# EAGLE design sdcard_noBMP (EAGLE 9.6.0)
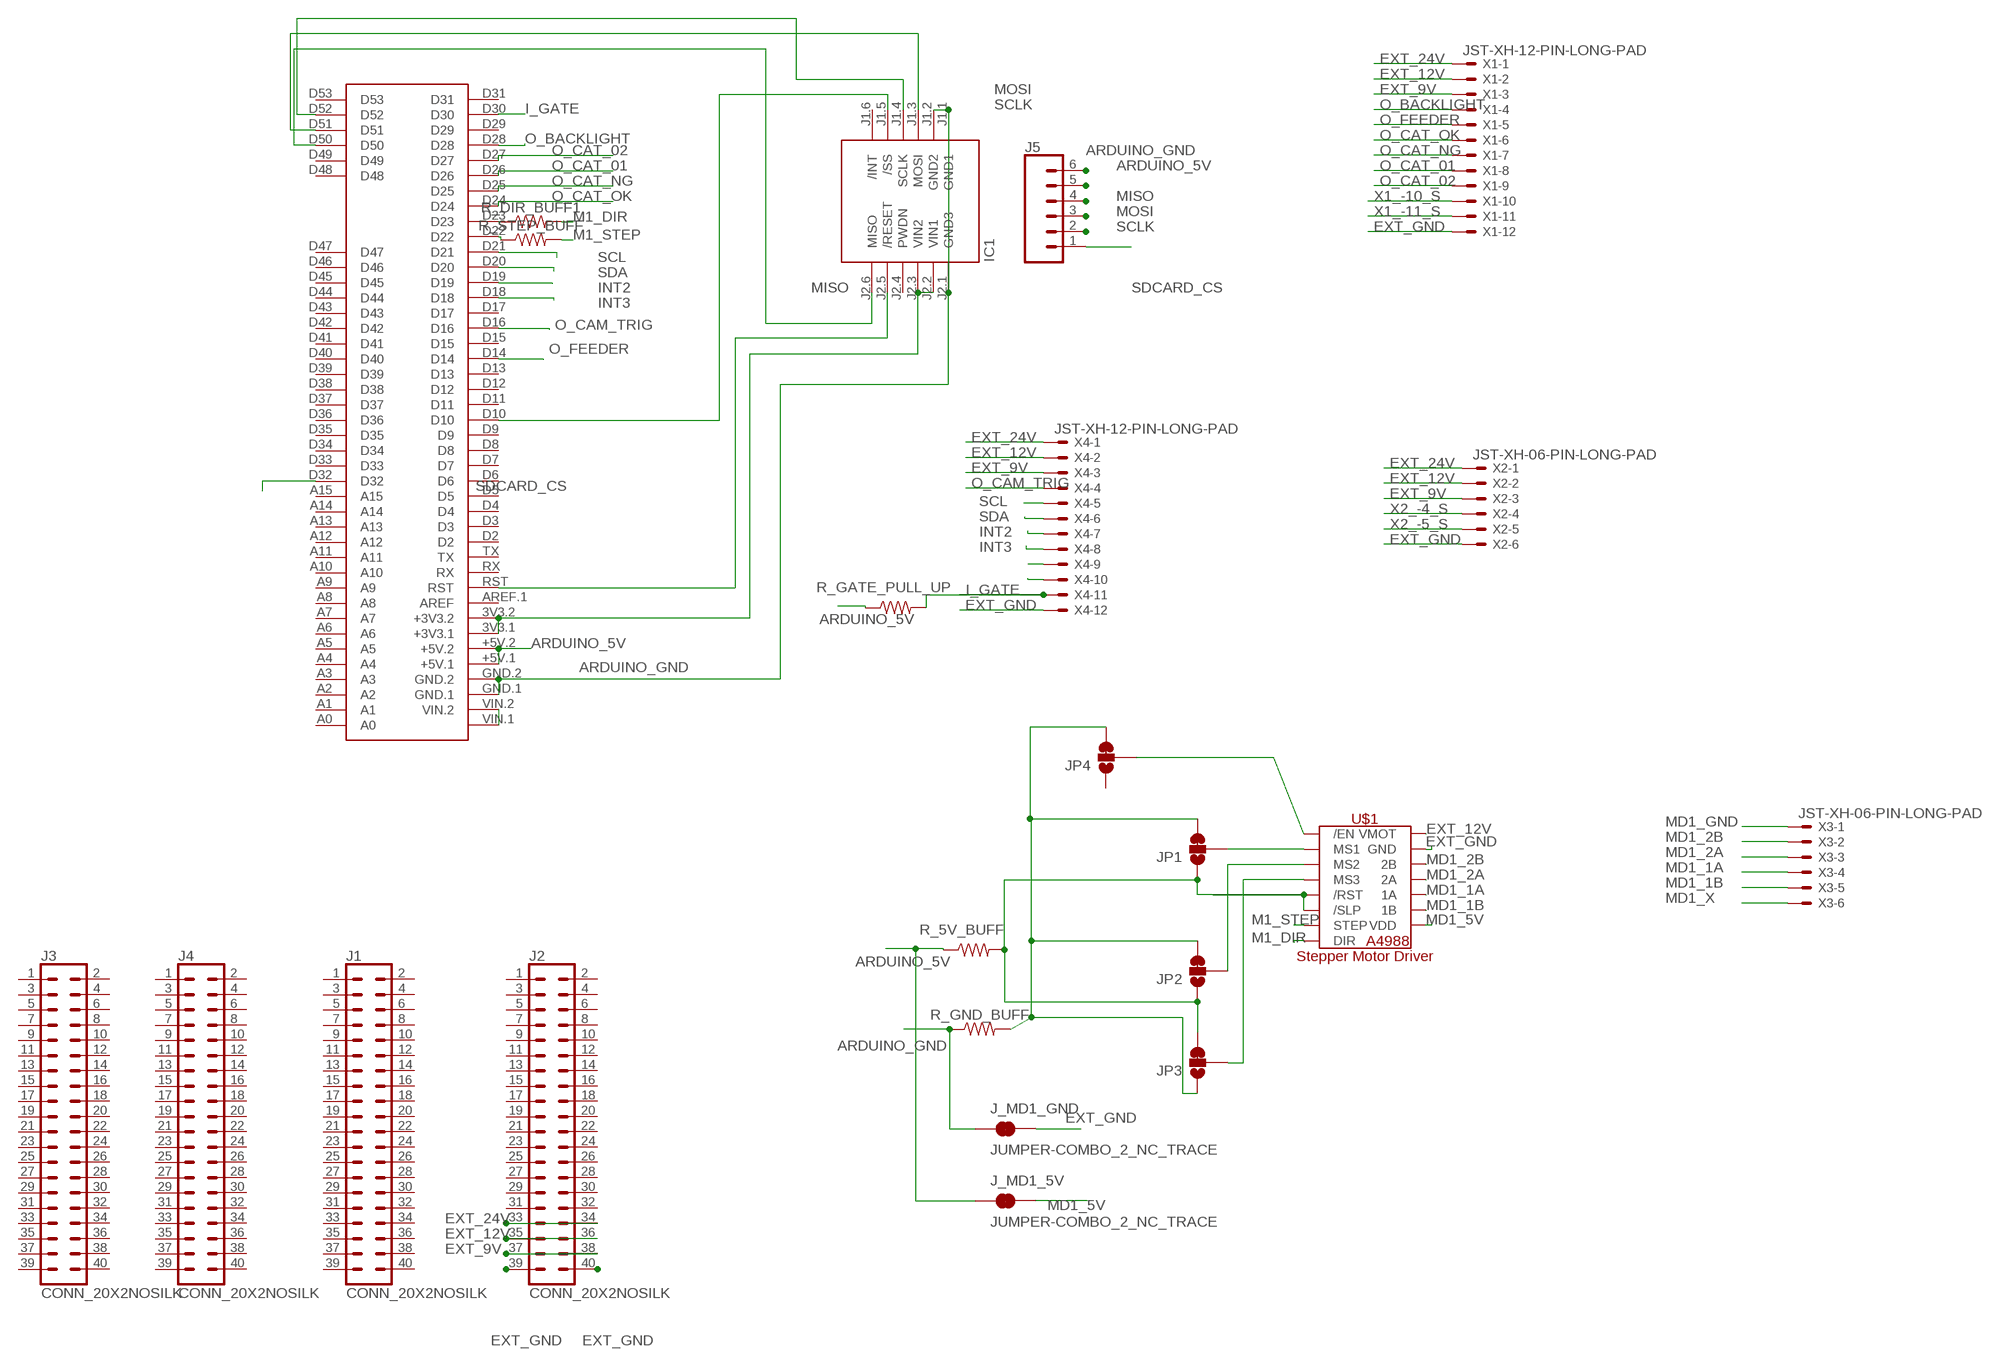
[diagram p0: schematic, sheet 1]

## Parts
IC1  WIZ820IO_DEVICE'DUAL-IN-LINE'  [WIZ820IO]
J1  CONN_20X2NOSILK  [2X20_NOSILK]
J2  CONN_20X2NOSILK  [2X20_NOSILK]
J3  CONN_20X2NOSILK  [2X20_NOSILK]
J4  CONN_20X2NOSILK  [2X20_NOSILK]
J5  CONN_06LOCK  [1X06_LOCK]
J_MD1_5V  JUMPER-COMBO_2_NC_TRACE  [COMBO-JUMPER_2_NC_TRACE]
J_MD1_GND  JUMPER-COMBO_2_NC_TRACE  [COMBO-JUMPER_2_NC_TRACE]
JP1  JUMPER-SMT_3_1-NC_TRACE_NO-SILK  [SMT-JUMPER_3_1-NC_TRACE_NO-SILK]
JP2  JUMPER-SMT_3_1-NC_TRACE_NO-SILK  [SMT-JUMPER_3_1-NC_TRACE_NO-SILK]
JP3  JUMPER-SMT_3_1-NC_TRACE_NO-SILK  [SMT-JUMPER_3_1-NC_TRACE_NO-SILK]
JP4  JUMPER-SMT_3_1-NC_TRACE_NO-SILK  [SMT-JUMPER_3_1-NC_TRACE_NO-SILK]
R_5V_BUFF  1k  1KOHM-0402T-1/16W-1%  [0402-TIGHT]
R_DIR_BUFF1  1k  1KOHM-0402T-1/16W-1%  [0402-TIGHT]
R_GATE_PULL_UP  1k  1KOHM-0402T-1/16W-1%  [0402-TIGHT]
R_GND_BUFF  1k  1KOHM-0402T-1/16W-1%  [0402-TIGHT]
R_STEP_BUFF  1k  1KOHM-0402T-1/16W-1%  [0402-TIGHT]
U$1  A4988_STEP  [A4988_STEP]
U$2  MEGA2560_MIKRO  [MEGA2560_MIKRO]
X1  JST-XH-12-PIN-LONG-PAD  [JST-XH-12-PACKAGE-LONG-PAD]
X2  JST-XH-06-PIN-LONG-PAD  [JST-XH-06-PACKAGE-LONG-PAD]
X3  JST-XH-06-PIN-LONG-PAD  [JST-XH-06-PACKAGE-LONG-PAD]
X4  JST-XH-12-PIN-LONG-PAD  [JST-XH-12-PACKAGE-LONG-PAD]

## Nets
ARDUINO_5V: J5.5 J_MD1_5V.1 J_MD1_5V.3 R_5V_BUFF.1 R_GATE_PULL_UP.1 U$2.+5V.1 U$2.+5V.2
ARDUINO_GND: IC1.J1.1(GND1) IC1.J1.2(GND2) IC1.J2.1(GND3) J5.6 J_MD1_GND.1 J_MD1_GND.3 R_GND_BUFF.1 U$2.GND.1 U$2.GND.2
EXT_9V: J2.37 J2.38 U$2.VIN.1 U$2.VIN.2 X1.3 X2.3 X4.3
EXT_12V: J2.35 J2.36 U$1.VMOT X1.2 X2.2 X4.2
EXT_24V: J2.33 J2.34 X1.1 X2.1 X4.1
EXT_GND: J2.39 J2.40 J_MD1_GND.2 J_MD1_GND.4 U$1.GND U$1.GND2(GND) X1.12 X2.6 X4.12
I_GATE: R_GATE_PULL_UP.2 U$2.D30 X4.11
INT2: U$2.D19 X4.7
INT3: U$2.D18 X4.8
M1_DIR: R_DIR_BUFF1.2 U$1.DIR
M1_STEP: R_STEP_BUFF.2 U$1.STEP
MD1_1A: U$1.1A X3.4
MD1_1B: U$1.1B X3.5
MD1_2A: U$1.2A X3.3
MD1_2B: U$1.2B X3.2
MD1_5V: J_MD1_5V.2 J_MD1_5V.4 U$1.VDD
MD1_GND: X3.1
MD1_X: X3.6
MISO: IC1.J2.6(MISO) J5.4 U$2.D50
MOSI: IC1.J1.3(MOSI) J5.3 U$2.D51
N$1: JP1.1 JP2.1 JP3.3 R_5V_BUFF.2 U$1./RST U$1./SLP
N$4: IC1.J1.5(/SS) U$2.D10
N$5: R_STEP_BUFF.1 U$2.D22
N$6: IC1.J2.5(/RESET) U$2.RST
N$8: IC1.J2.2(VIN1) IC1.J2.3(VIN2) U$2.3V3.1(+3V3.1) U$2.3V3.2(+3V3.2)
N$10: JP1.2 U$1.MS1
N$11: JP2.2 U$1.MS2
N$12: JP3.2 U$1.MS3
N$13: JP4.2 U$1./EN
N$14: JP1.3 JP2.3 JP3.1 JP4.3 R_GND_BUFF.2
N$15: R_DIR_BUFF1.1 U$2.D23
N$19: X4.9
N$20: X4.10
O_BACKLIGHT: U$2.D28 X1.4
O_CAM_TRIG: U$2.D16 X4.4
O_CAT_01: U$2.D26 X1.8
O_CAT_02: U$2.D27 X1.9
O_CAT_NG: U$2.D25 X1.7
O_CAT_OK: U$2.D24 X1.6
O_FEEDER: U$2.D14 X1.5
SCL: U$2.D21 X4.5
SCLK: IC1.J1.4(SCLK) J5.2 U$2.D52
SDA: U$2.D20 X4.6
SDCARD_CS: J5.1 U$2.D32
X1_-10_S: X1.10
X1_-11_S: X1.11
X2_-4_S: X2.4
X2_-5_S: X2.5
Unconnected: IC1.J1.6(/INT) IC1.J2.4(PWDN) J1.1 J1.2 J1.3 J1.4 J1.5 J1.6 J1.7 J1.8 J1.9 J1.10 J1.11 J1.12 J1.13 J1.14 J1.15 J1.16 J1.17 J1.18 J1.19 J1.20 J1.21 J1.22 J1.23 J1.24 J1.25 J1.26 J1.27 J1.28 J1.29 J1.30 J1.31 J1.32 J1.33 J1.34 J1.35 J1.36 J1.37 J1.38 J1.39 J1.40 J2.1 J2.2 J2.3 J2.4 J2.5 J2.6 J2.7 J2.8 J2.9 J2.10 J2.11 J2.12 J2.13 J2.14 J2.15 J2.16 J2.17 J2.18 J2.19 J2.20 J2.21 J2.22 J2.23 J2.24 J2.25 J2.26 J2.27 J2.28 J2.29 J2.30 J2.31 J2.32 J3.1 J3.2 J3.3 J3.4 J3.5 J3.6 J3.7 J3.8 J3.9 J3.10 J3.11 J3.12 J3.13 J3.14 J3.15 J3.16 J3.17 J3.18 J3.19 J3.20 J3.21 J3.22 J3.23 J3.24 J3.25 J3.26 J3.27 J3.28 J3.29 J3.30 J3.31 J3.32 J3.33 J3.34 J3.35 J3.36 J3.37 J3.38 J3.39 J3.40 J4.1 J4.2 J4.3 J4.4 J4.5 J4.6 J4.7 J4.8 J4.9 J4.10 J4.11 J4.12 J4.13 J4.14 J4.15 J4.16 J4.17 J4.18 J4.19 J4.20 J4.21 J4.22 J4.23 J4.24 J4.25 J4.26 J4.27 J4.28 J4.29 J4.30 J4.31 J4.32 J4.33 J4.34 J4.35 J4.36 J4.37 J4.38 J4.39 J4.40 JP4.1 U$2.A0 U$2.A1 U$2.A2 U$2.A3 U$2.A4 U$2.A5 U$2.A6 U$2.A7 U$2.A8 U$2.A9 U$2.A10 U$2.A11 U$2.A12 U$2.A13 U$2.A14 U$2.A15 U$2.AREF.1(AREF) U$2.D2 U$2.D3 U$2.D4 U$2.D5 U$2.D6 U$2.D7 U$2.D8 U$2.D9 U$2.D11 U$2.D12 U$2.D13 U$2.D15 U$2.D17 U$2.D29 U$2.D31 U$2.D33 U$2.D34 U$2.D35 U$2.D36 U$2.D37 U$2.D38 U$2.D39 U$2.D40 U$2.D41 U$2.D42 U$2.D43 U$2.D44 U$2.D45 U$2.D46 U$2.D47 U$2.D48 U$2.D49 U$2.D53 U$2.RX U$2.TX

## Library data of the parts
IC1 = Wiz820io:WIZ820IO_DEVICE: WIZnet, WIZ820io plug in module incl. W5200 chip and MagJack
J1-J4 = SparkFun-Connectors:CONN_20X2: Multi connection point. Often used as Generic Header-pin footprint for 0.1 inch spaced/style header connections On any of the 0.1 inch spaced packages, you can populate with these: Break Away Headers - Straight <https://www.sparkfun.com/products/116> (PRT-00116) Break Away Male Headers - Right Angle <https://www.sparkfun.com/products/553> (PRT-00553) Female Headers <https://www.sparkfun.com/products/115> (PRT-00115) Break Away Headers - Machine Pin <https://www.sparkfun.com/products/117> (PRT-00117) Break Away Female Headers - Swiss Machine Pin <https://www.sparkfun.com/products/743> (PRT-00743)
J5 = SparkFun-Connectors:CONN_06: Multi connection point. Often used as Generic Header-pin footprint for 0.1 inch spaced/style header connections On any of the 0.1 inch spaced packages, you can populate with these: Break Away Headers - Straight <https://www.sparkfun.com/products/116> (PRT-00116) Break Away Male Headers - Right Angle <https://www.sparkfun.com/products/553> (PRT-00553) Female Headers <https://www.sparkfun.com/products/115> (PRT-00115) Break Away Headers - Machine Pin <https://www.sparkfun.com/products/117> (PRT-00117) Break Away Female Headers - Swiss Machine Pin <https://www.sparkfun.com/products/743> (PRT-00743) Arduino Stackable Header - 6 Pin <https://www.sparkfun.com/products/9280> (PRT-09280) For SCREWTERMINALS and SPRING TERMINALS visit here: Screw Terimnals on SparkFun.com <https://www.sparkfun.com/search/results?term=Screw+Terminals> (5mm/3.5mm/2.54mm spacing) This device is also useful as a general connection point to wire up your design to another part of your project. Our various solder wires solder well into these plated through hole pads. Hook-Up Wire - Assortment (Stranded, 22 AWG) <https://www.sparkfun.com/products/11375> (PRT-11375) Hook-Up Wire - Assortment (Solid Core, 22 AWG) <https://www.sparkfun.com/products/11367> (PRT-11367) View the entire wire category on our website here <https://www.sparkfun.com/categories/141>
J_MD1_5V J_MD1_GND = SparkFun-Jumpers:JUMPER-COMBO_2_NC_TRACE
JP1-JP4 = SparkFun-Jumpers:JUMPER-SMT_3_1-NC_TRACE: Normally closed trace jumper (1 of 2 connections) This jumper has a trace between two pads so it's normally closed (NC). The other connection is normally open (NO). Use a razor knife to open the connection. For best results follow the IPC guidelines for cutting traces: Cutout at least 0.063 mm (0.005 in). Remove all loose material to clean up the cut area. Seal the cut with an approved epoxy. Reapply solder to reclose the connection, or to close the NO connection.
R_5V_BUFF R_DIR_BUFF1 R_GATE_PULL_UP R_GND_BUFF R_STEP_BUFF = SparkFun-Resistors:1KOHM: 1kΩ resistor A resistor is a passive two-terminal electrical component that implements electrical resistance as a circuit element. Resistors act to reduce current flow, and, at the same time, act to lower voltage levels within circuits. - Wikipedia; PROD_ID: RES-14342
U$1 = XXXICs:A4988_STEP
U$2 = MIKRO_MEGA2560:MEGA2560_MIKRO: Arduino Mega2560 pro robotDyn, create by mikroavr.com
X1 X4 = Rembrandt Electronics - JST XH Connectors v1-0:JST-XH-12-PIN: JST XH Connector 2 Pin Wire to board connector. Pitch: 2,54 mm, (0.100") Number of pins: 12 Created by Rembrandt Electronics www.rembrandtelectronics.com
X2 X3 = Rembrandt Electronics - JST XH Connectors v1-0:JST-XH-06-PIN: JST XH Connector 2 Pin Wire to board connector. Pitch: 2,54 mm, (0.100") Number of pins: 6 Created by Rembrandt Electronics www.rembrandtelectronics.com

## Board
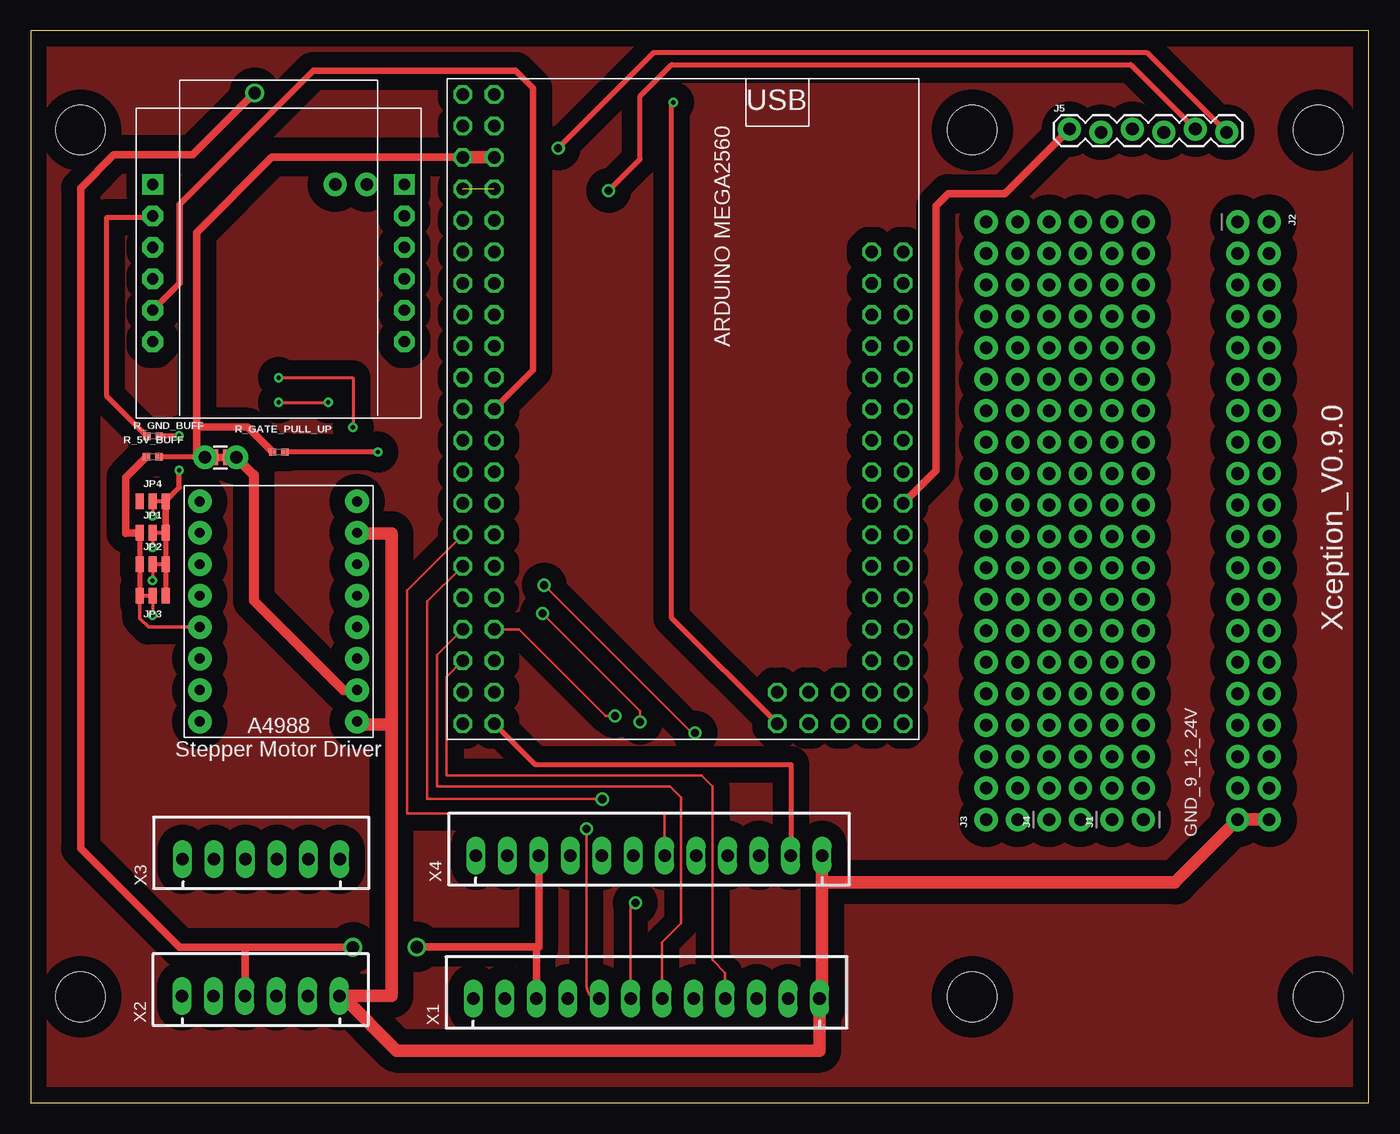
[diagram p1: board, top side]
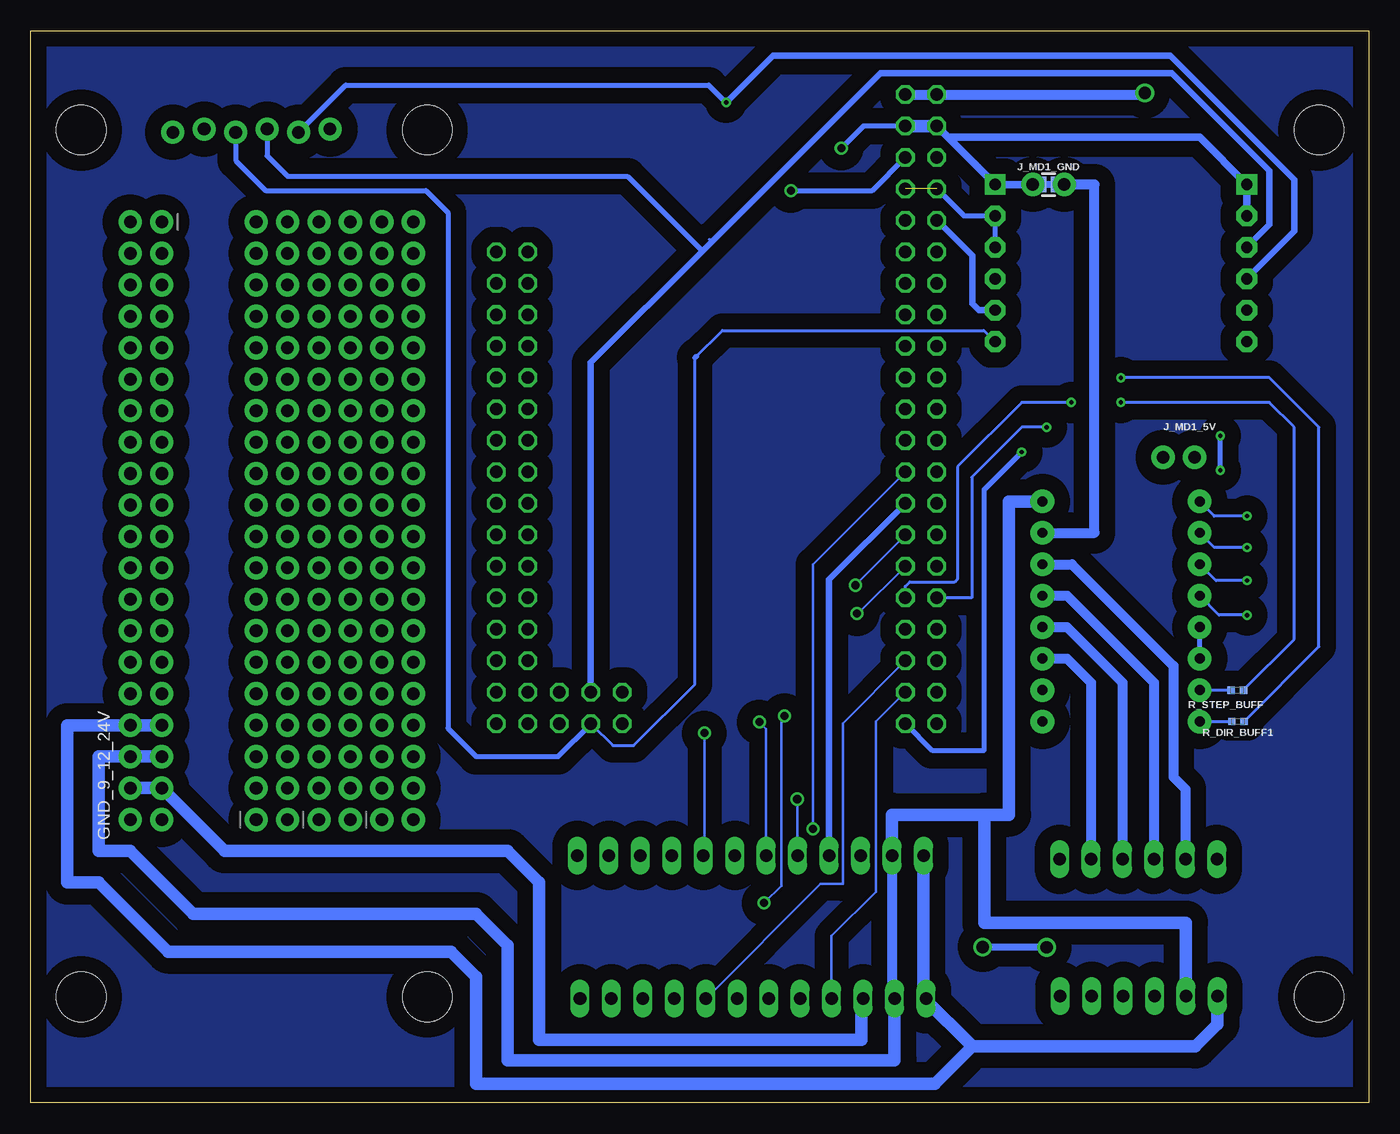
[diagram p2: board, bottom side, seen from below]

Size 108 x 86.54 mm. Coordinates in mm from the lower left corner, seen from the top.
Outline: 0,0 108,0 108,86.54 0,86.54 0,0
Copper layers (1*16): Top 0.035mm / dielectric 1.5mm / Bottom 0.035mm
Design rules "default": minimum track width 6mil, minimum drill 0.35mm, track to track 6mil, track to pad 6mil, pad to pad 6mil, via to via 6mil, smd to smd 6mil, copper to edge 40mil, drill to drill 6mil, minimum pad ring 10mil, minimum via ring 8mil, stop-mask expansion 4mil, vias tented up to drill 0mil, thermal gap 10mil
Holes 4 mm at 4,78.54 76,78.54 76,8.54 4,8.54 103.94,78.54 103.94,8.54

### Footprints (pad centres in the part's own frame; a part is rotated, then mirrored left to right if it is on the bottom)
WIZ820IO = drill 0.9 pad 1.676 square: J1.1 -10.16,6.35; J2.1 10.16,6.35 | drill 0.9 pad 1.676 octagon: J1.2 -10.16,3.81; J1.3 -10.16,1.27; J1.4 -10.16,-1.27; J1.5 -10.16,-3.81; J1.6 -10.16,-6.35; J2.2 10.16,3.81; J2.3 10.16,1.27; J2.4 10.16,-1.27; J2.5 10.16,-3.81; J2.6 10.16,-6.35
2X20_NOSILK = drill 1.016 pad 1.88: 1 0,0; 2 0,2.54; 3 2.54,0; 4 2.54,2.54; 5 5.08,0; 6 5.08,2.54; 7 7.62,0; 8 7.62,2.54; 9 10.16,0; 10 10.16,2.54; 11 12.7,0; 12 12.7,2.54; 13 15.24,0; 14 15.24,2.54; 15 17.78,0; 16 17.78,2.54; 17 20.32,0; 18 20.32,2.54; 19 22.86,0; 20 22.86,2.54; 21 25.4,0; 22 25.4,2.54; 23 27.94,0; 24 27.94,2.54; 25 30.48,0; 26 30.48,2.54; 27 33.02,0; 28 33.02,2.54; 29 35.56,0; 30 35.56,2.54; 31 38.1,0; 32 38.1,2.54; 33 40.64,0; 34 40.64,2.54; 35 43.18,0; 36 43.18,2.54; 37 45.72,0; 38 45.72,2.54; 39 48.26,0; 40 48.26,2.54
1X06_LOCK = drill 1.016 pad 1.88: 1 0,0; 2 2.54,-0.254; 3 5.08,0; 4 7.62,-0.254; 5 10.16,0; 6 12.7,-0.254
COMBO-JUMPER_2_NC_TRACE = smd 0.635 x 1.27: 1 -0.508,0; 2 0.508,0 | drill 1.016 pad 1.88: 3 -1.27,0; 4 1.27,0
SMT-JUMPER_3_1-NC_TRACE_NO-SILK = smd 0.66 x 1.27: 1 -1.041,0; 2 0,0; 3 1.041,0
0402-TIGHT = smd 0.6 x 0.6: 1 -0.5,0; 2 0.5,0
A4988_STEP = drill 0.8 pad 1.905: 1A 6.35,-1.27; 1B 6.35,-3.81; 2A 6.35,1.27; 2B 6.35,3.81; /EN -6.35,8.89; /RST -6.35,-1.27; /SLP -6.35,-3.81; DIR -6.35,-8.89; GND 6.35,6.35; GND2 6.35,-8.89; MS1 -6.35,6.35; MS2 -6.35,3.81; MS3 -6.35,1.27; STEP -6.35,-6.35; VDD 6.35,-6.35; VMOT 6.35,8.89
MEGA2560_MIKRO = drill 1 octagon: 3V3.1 -26.67,-17.78; 3V3.2 -26.67,-20.32; +5V.1 -29.21,-17.78; +5V.2 -29.21,-20.32; A0 -21.59,15.24; A1 -21.59,12.7; A2 -19.05,15.24; A3 -19.05,12.7; A4 -16.51,15.24; A5 -16.51,12.7; A6 -13.97,15.24; A7 -13.97,12.7; A8 -11.43,15.24; A9 -11.43,12.7; A10 -8.89,15.24; A11 -8.89,12.7; A12 -6.35,15.24; A13 -6.35,12.7; A14 -3.81,15.24; A15 -3.81,12.7; AREF.1 -24.13,-17.78; D2 -19.05,-17.78; D3 -19.05,-20.32; D4 -16.51,-17.78; D5 -16.51,-20.32; D6 -13.97,-17.78; D7 -13.97,-20.32; D8 -11.43,-17.78; D9 -11.43,-20.32; D10 -8.89,-17.78; D11 -8.89,-20.32; D12 -6.35,-17.78; D13 -6.35,-20.32; D14 -3.81,-17.78; D15 -3.81,-20.32; D16 -1.27,-17.78; D17 -1.27,-20.32; D18 1.27,-17.78; D19 1.27,-20.32; D20 3.81,-17.78; D21 3.81,-20.32; D22 6.35,-17.78; D23 6.35,-20.32; D24 8.89,-17.78; D25 8.89,-20.32; D26 11.43,-17.78; D27 11.43,-20.32; D28 13.97,-17.78; D29 13.97,-20.32; D30 16.51,-17.78; D31 16.51,-20.32; D32 -1.27,15.24; D33 -1.27,12.7; D34 1.27,15.24; D35 1.27,12.7; D36 3.81,15.24; D37 3.81,12.7; D38 6.35,15.24; D39 6.35,12.7; D40 8.89,15.24; D41 8.89,12.7; D42 11.43,15.24; D43 11.43,12.7; D44 13.97,15.24; D45 13.97,12.7; D46 16.51,15.24; D47 16.51,12.7; D48 16.51,10.16; D49 13.97,10.16; D50 16.51,7.62; D51 13.97,7.62; D52 16.51,5.08; D53 13.97,5.08; GND.1 -31.75,-17.78; GND.2 -31.75,-20.32; RST -24.13,-20.32; RX -21.59,-17.78; TX -21.59,-20.32; VIN.1 -34.29,-17.78; VIN.2 -34.29,-20.32
JST-XH-12-PACKAGE-LONG-PAD = drill 1.016 long: 1 -13.97,0; 2 -11.43,0; 3 -8.89,0; 4 -6.35,0; 5 -3.81,0; 6 -1.27,0; 7 1.27,0; 8 3.81,0; 9 6.35,0; 10 8.89,0; 11 11.43,0; 12 13.97,0
JST-XH-06-PACKAGE-LONG-PAD = drill 1.016 long: 1 -6.35,0; 2 -3.81,0; 3 -1.27,0; 4 1.27,0; 5 3.81,0; 6 6.35,0

### Placement (x,y rotation side)
IC1  19.99,67.8 0 top
J1  89.82,22.86 90 top
J2  97.44,71.12 270 top
J3  79.66,22.86 90 top
J4  84.74,22.86 90 top
J5  83.85,78.61 0 top
J_MD1_5V  15.31,52.11 0 top
J_MD1_GND  25.84,74.15 0 bottom
JP1  9.83,46.02 0 top
JP2  9.83,43.48 0 top
JP3  9.83,40.94 180 top
JP4  9.83,48.56 0 top
R_5V_BUFF  9.84,52.16 180 top
R_DIR_BUFF1  10.54,30.78 180 bottom
R_GATE_PULL_UP  20.01,52.54 0 top
R_GND_BUFF  9.85,53.82 0 top
R_STEP_BUFF  10.6,33.31 180 bottom
U$1  19.99,39.67 0 top
U$2  55.18,47.12 270 top
X1  49.7,8.4 0 top
X2  18.54,8.61 0 top
X3  18.59,19.66 0 top
X4  49.9,19.96 0 top

### Tracks (layer width: path | path; a pad name or v marks a point on that pad's centre or on a via)
ARDUINO_5V  (via drill 0.65)
  Top 0.203: J_MD1_5V.3 J_MD1_5V.1
  Top 0.406: R_5V_BUFF.1 13.37,52.16 13.99,52.16 J_MD1_5V.3 | v46.64,73.66 49.18,76.2 49.18,81.28 51.72,83.82 88.8,83.82 J5.5
  Top 0.61: U$2.+5V.2 19.43,76.33 13.37,70.26 13.37,54.54 | 13.37,54.54 13.37,52.16 | R_GATE_PULL_UP.1 17.51,54.54 13.37,54.54
  Top 1.016: U$2.+5V.1 U$2.+5V.2
  Bottom 0.406: v46.64,73.66 40.07,73.66 U$2.+5V.1
ARDUINO_GND  (via drill 0.65)
  Top 0.406: R_GND_BUFF.1 6.13,57.05 6.13,71.5 9.72,71.5 IC1.J1.2 | v42.58,77.09 50.3,84.81 90.1,84.81 J5.6
  Bottom 0.203: J_MD1_GND.1 J_MD1_GND.3
  Bottom 0.406: U$2.GND.2 34.86,78.86 | U$2.GND.1 40.8,78.87 v42.58,77.09
  Bottom 0.61: 33.96,77.96 IC1.J2.1 J_MD1_GND.3 | 33.96,77.96 34.86,78.86 | 33.96,77.96 13.64,77.96 IC1.J1.1 IC1.J1.2
  Bottom 1.016: U$2.GND.2 U$2.GND.1
B_CP
  pour Bottom (isolate 1.27): 0,86.54 0,0 108,0 108,86.54
EXT_9V  (via drill 1)
  Top 0.61: 17.21,12.54 12,12.54 4,20.54 4,73.84 6.7,76.54 13.07,76.54 v18.06,81.53 | 17.21,12.54 17.3,12.45 17.3,8.64 X2.3 | 17.21,12.54 v26,12.54 | v31.15,12.57 40.81,12.57 | X4.3 41.01,12.57 40.81,12.57 | X1.3 40.81,12.57
  Bottom 0.61: v31.15,12.57 v26.01,12.55 v26,12.54
  Bottom 0.813: U$2.VIN.1 U$2.VIN.2 18.19,81.41 v18.06,81.53
  Bottom 1.016: J2.38 J2.37 92.36,20.32 69.5,20.32 66.96,17.78 66.96,5.08 40.92,5.08 40.92,8.28 X1.3
EXT_12V
  Bottom 0.813: X4.2 38.47,8.4 X1.2
  Bottom 1.016: U$1.VMOT 29.02,48.56 29.02,23.24 31.02,23.24 | X4.2 38.47,23.24 31.02,23.24 | X2.2 14.73,14.54 31.02,14.54 31.02,23.24 | J2.35 J2.36 102.52,27.94 102.52,20.32 99.98,20.32 94.9,15.24 72.04,15.24 69.5,12.7 69.5,3.43 38.27,3.43 X1.2
EXT_24V
  Bottom 1.016: X2.1 12.19,6.35 14,4.54 32,4.54 | 32,4.54 35.93,8.47 35.93,8.6 | X1.1 35.93,8.6 | 35.93,8.6 X4.1 | J2.33 J2.34 105.06,30.48 105.06,17.78 102.52,17.78 96.93,12.19 74.07,12.19 72.04,10.16 72.04,1.52 35.02,1.52 32,4.54
EXT_GND
  Top 1.016: X2.6 25.11,8.61 | 25.11,8.61 29.11,8.61 29.11,30.54 | 29.11,30.54 29.11,45.97 26.34,45.97 U$1.GND | X4.12 63.87,17.78 | 63.87,17.78 63.87,8.4 | 63.87,8.4 X1.12 | 25.11,8.61 29.53,4.19 63.66,4.19 63.66,8.18 63.87,8.4 | U$1.GND2 26.57,30.54 29.11,30.54 | J2.40 J2.39 92.36,17.78 63.87,17.78
  Bottom 0.203: J_MD1_GND.2 J_MD1_GND.4
  Bottom 0.813: U$1.GND 22.13,46.02 22.13,74.15 J_MD1_GND.4
I_GATE  (via drill 0.35)
  Top 0.406: U$2.D30 40.7,27.3 61.37,27.3 61.37,20 X4.11 | v28,52.54 R_GATE_PULL_UP.2
  Bottom 0.406: U$2.D30 35.24,28.45 31.02,28.45 31.02,49.52 v28,52.54
INT2
  Top 0.203: U$2.D19 30.38,41.38 30.38,23.37 51.17,23.37 X4.7
INT3  (via drill 0.65)
  Top 0.203: v41.43,41.78 53.37,29.84 v53.62,29.84
  Bottom 0.203: U$2.D18 41.43,41.81 v41.43,41.78 | v53.62,29.84 53.62,20.05 X4.8
M1_DIR
  Bottom 0.254: U$1.DIR R_DIR_BUFF1.2
M1_STEP
  Bottom 0.254: U$1.STEP R_STEP_BUFF.2
MD1_1A
  Bottom 0.813: U$1.1A 24.34,38.4 19.86,33.92 X3.4
MD1_1B
  Bottom 0.813: U$1.1B 24.34,35.86 22.4,33.92 X3.5
MD1_2A
  Bottom 0.813: U$1.2A 24.34,40.94 17.32,33.92 X3.3
MD1_2B
  Bottom 0.813: U$1.2B 23.95,43.48 15.75,35.27 15.75,26.29 14.78,25.32 X3.2
MD1_5V
  Top 0.508: J_MD1_5V.2 J_MD1_5V.4
  Top 0.813: J_MD1_5V.4 18,50.69 18,40.54 25.22,33.32 U$1.VDD
MISO
  Bottom 0.254: IC1.J2.6 31.06,62.36 52.18,62.36 54.39,60.15 54.39,33.78 59.34,28.83 61.02,28.83 62.78,30.59 U$2.D50
  Bottom 0.406: 54.26,60.28 54.39,60.15 | J5.4 91.47,76.07 89.06,73.66 76.1,73.66 74.33,71.88 74.33,30.23 72.04,27.94 65.44,27.94 62.78,30.59
MOSI
  Bottom 0.254: 53.22,69.7 52.84,69.7
  Bottom 0.406: J5.3 88.93,76.45 87.28,74.8 59.85,74.8 53.79,68.75
  Bottom 0.508: IC1.J1.3 8,70.9 8,75.27 15.87,83.14 39.4,83.14 52.84,69.7 53.79,68.75 62.8,59.74 U$2.D51
N$1
  Top 0.152: JP3.3 8.76,40.94 | 8.79,43.38 8.81,43.38 JP2.1
  Top 0.3: U$1./RST 9.5,38.4 8.79,39.11 JP3.3
  Top 0.406: JP1.1 JP2.1 8.79,43.38 8.79,41.24 8.76,41.21 8.76,40.94
  Top 0.61: R_5V_BUFF.2 7.65,50.47 7.65,45.97 7.69,46.02 JP1.1
  Bottom 0.406: U$1./SLP U$1./RST
N$4
  Top 0.508: IC1.J1.5 12,66.16 12,72.54 22.77,83.31 39.15,83.31 40.54,81.92 40.54,59.16 U$2.D10
N$5  (via drill 0.35)
  Top 0.254: v20,56.54 v24,56.54
  Bottom 0.254: R_STEP_BUFF.1 6,37.41 6,54.54 8,56.54 v20,56.54 | v24,56.54 28,56.54 33.18,51.36 33.18,42.29 33.41,42.06 37.03,42.06 37.4,41.69 U$2.D22
N$6
  Bottom 0.508: U$2.RST 32,68.39 32,64.54 31.45,63.99 IC1.J2.5
N$8  (1 unrouted)
  Bottom 0.406: U$2.3V3.2 32.67,71.61 IC1.J2.2 IC1.J2.3
N$10  (via drill 0.35)
  Top 0.254: JP1.2 9.83,44.85 v9.81,44.83
  Bottom 0.254: v9.81,44.83 12.45,44.83 U$1.MS1
N$11  (via drill 0.35)
  Top 0.254: JP2.2 9.83,42.18 v9.81,42.16
  Bottom 0.254: v9.81,42.16 12.33,42.16 U$1.MS2
N$12  (via drill 0.35)
  Top 0.254: JP3.2 9.83,39.39 v9.81,39.37
  Bottom 0.254: v9.81,39.37 12.07,39.37 U$1.MS3
N$13  (via drill 0.35)
  Top 0.254: JP4.2 9.83,47.39 v9.81,47.37
  Bottom 0.254: v9.81,47.37 12.45,47.37 U$1./EN
N$14  (via drill 0.35)
  Top 0.152: JP2.3 10.95,43.53 10.87,43.53 | 10.87,45.97 10.95,45.97 JP1.3
  Top 0.406: JP1.3 10.87,45.97 10.87,43.53 JP2.3 JP3.1 | JP4.3 11.97,49.66 v11.97,51.05 | v11.97,53.85 10.38,53.85 R_GND_BUFF.2
  Top 0.508: JP4.3 JP1.3
  Bottom 0.406: v11.97,51.05 v11.97,53.85
N$15  (via drill 0.35)
  Top 0.254: v20,58.54 26,58.54 v26,54.54
  Bottom 0.254: R_DIR_BUFF1.1 4,36.83 4,54.54 8,58.54 v20,58.54 | v26,54.54 28,54.54 32.03,50.51 32.03,40.77 U$2.D23
O_BACKLIGHT
  Bottom 0.203: U$2.D28 39.78,30.77 39.78,17.02 43.35,13.45 X1.4
O_CAM_TRIG
  Bottom 0.508: U$2.D16 43.55,42.23 X4.4
O_CAT_01
  Bottom 0.203: X1.8 44.25,17.65 42.45,17.65 42.45,30.64 U$2.D26
O_CAT_02
  Top 0.203: U$2.D27 33.56,34.39 33.56,26.42 54.13,26.42 55.02,25.53 55.02,11.52 56.05,10.49 X1.9
O_CAT_NG
  Top 0.203: U$2.D25 32.8,36.17 32.8,25.53 51.59,25.53 52.48,24.64 52.48,14.48 50.96,12.95 50.96,8.41 X1.7
O_CAT_OK  (via drill 0.65)
  Top 0.203: U$2.D24 39.4,38.23 46.39,31.24 v47.15,31.24 | v48.8,16.13 48.43,15.76 X1.6
  Bottom 0.203: v47.15,31.24 47.4,30.99 47.4,17.53 v48.8,16.13
O_FEEDER  (via drill 0.65)
  Top 0.203: X1.5 arc-90 44.86,9.43 v44.86,22.1
  Bottom 0.203: v44.86,22.1 44.86,43.47 U$2.D14
SCL  (via drill 0.65)
  Top 0.203: v46.13,24.51 46.1,24.54 32,24.54 32,40.45 U$2.D21
  Bottom 0.203: X4.5 46.09,24.47 v46.13,24.51
SCLK  (via drill 0.35)
  Top 0.406: U$2.D52 51.72,39.15 51.72,80.61 v51.87,80.76
  Bottom 0.406: J5.2 82.58,82.17 53.28,82.17 v51.87,80.76
  Bottom 0.508: IC1.J1.4 6,70.36 6,74.54 16,84.54 48.1,84.54 v51.87,80.76
SDA  (via drill 0.65)
  Top 0.203: v41.31,39.5 49.18,31.62 v49.18,30.73
  Bottom 0.203: U$2.D20 41.21,39.5 v41.31,39.5 | v49.18,30.73 48.63,30.19 X4.6
SDCARD_CS
  Top 0.61: U$2.D32 73.06,51.03 73.06,72.39 74.07,73.41 78.64,73.41 J5.1
T_CP
  pour Top (isolate 1.27): 108,86.54 0,86.54 0,0 108,0

### Text on the board
tPlace: Xception_V0.9.0 | GND_9_12_24V
bPlace: GND_9_12_24V